# Altium schematic sheet CAN.SchDoc
size A4; SheetNumber: 3; SheetTotal: 5
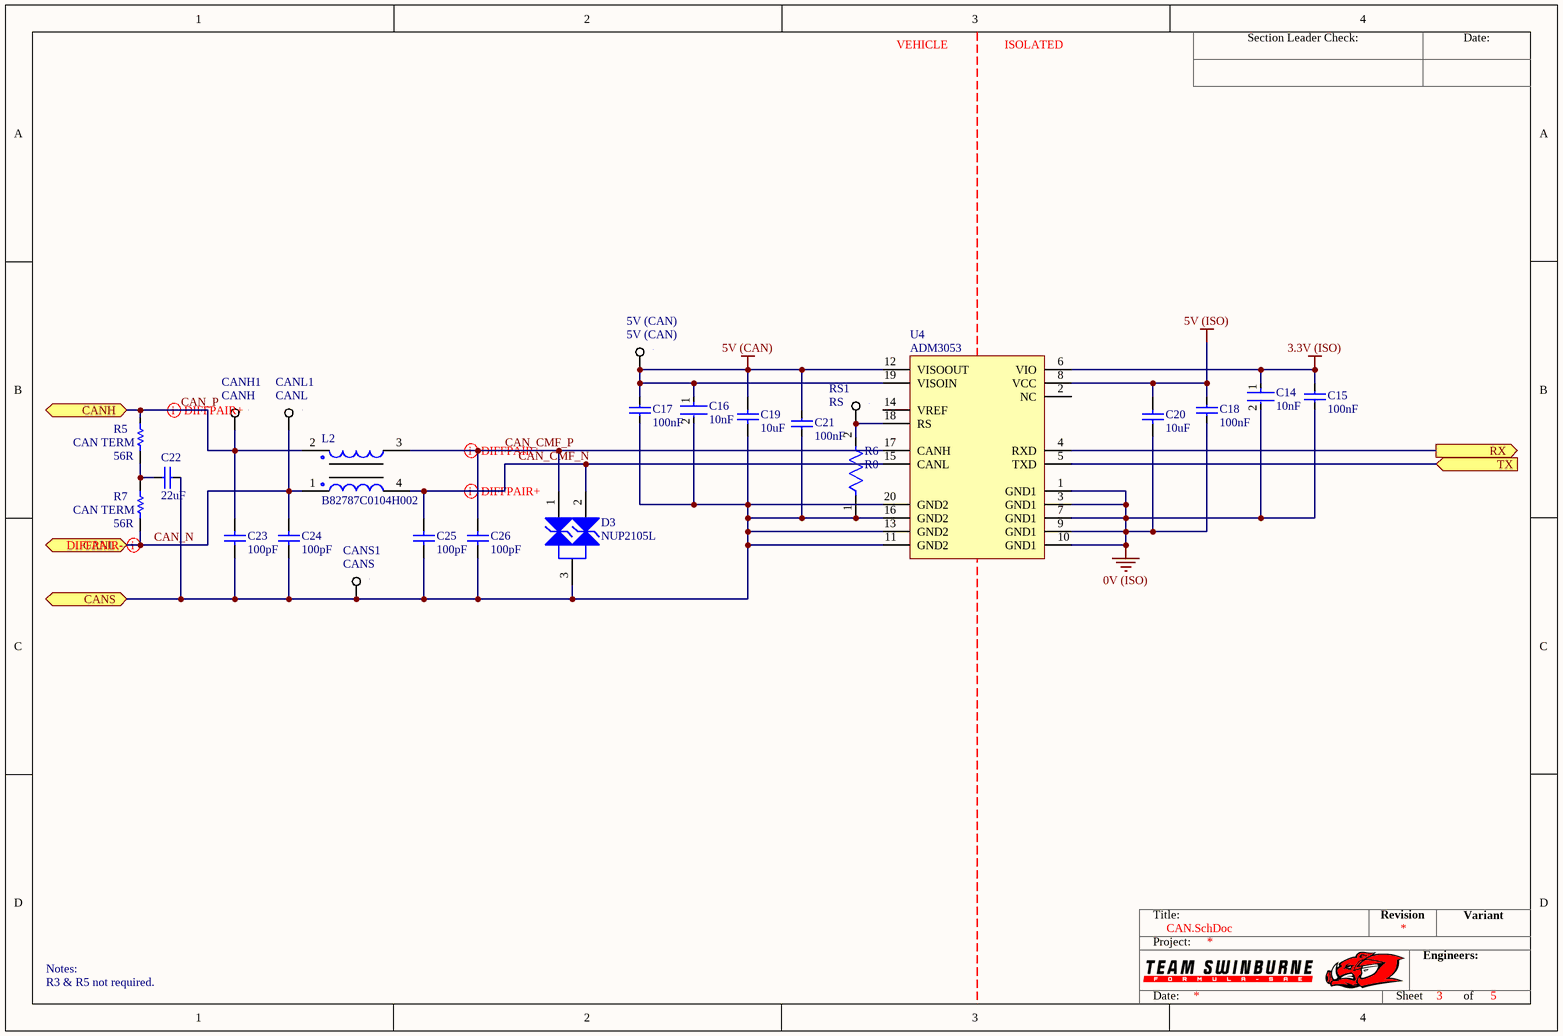
[diagram p0: CAN.SchDoc]

## Parts
5V_(CAN)  5V (CAN)  [SMD Test Point 1mm]
C14  10nF  [FP-GCM319-0_15-IPC_A]
C15  100nF  [0805]
C16  10nF  [FP-GCM319-0_15-IPC_A]
C17  100nF  [0805]
C18  100nF  [0805]
C19  10uF  [CAPC2013X145X50NL20T25]
C20  10uF  [CAPC2013X145X50NL20T25]
C21  100nF  [0805]
C22  22uF  [C0805C226M9PAC7210-Footprint-1]
C23  100pF  [CAPC2013X70X45NL15T25]
C24  100pF  [CAPC2013X70X45NL15T25]
C25  100pF  [CAPC2013X70X45NL15T25]
C26  100pF  [CAPC2013X70X45NL15T25]
CANH1  CANH  [SMD Test Point 1mm]
CANL1  CANL  [SMD Test Point 1mm]
CANS1  CANS  [SMD Test Point 1mm]
D3  NUP2105L  [ONSC-SOT-23-3-318-08_V]
L2  B82787C0104H002  [TDK 4-PC Pad]
R5  CAN TERM  value 56R  [RESC0603]
R6  R0  [FP-RC0805-IPC_A]
R7  CAN TERM  value 56R  [RESC0603]
RS1  RS  [SMD Test Point 1mm]
U4  ADM3053  [AD SOIC-W 20]

## Ports
CANH (bidir), CANL (bidir), CANS (bidir), RX (out), TX (in)

## Nets
0V (ISO): C14.2 C15.2 C18.2 C20.1 U4.1(GND1) U4.3(GND1) U4.7(GND1) U4.9(GND1) U4.10(GND1)
3.3V (ISO): C14.1 C15.1 U4.6(VIO)
5V (CAN): 5V_(CAN).1 C16.1 C17.1 C19.2 C21.1 U4.12(VISOOUT) U4.19(VISOIN)
5V (ISO): C18.1 C20.2 U4.8(VCC)
CAN_CMF_N: C25.2 D3.2(K) L2.4 U4.15(CANL)
CAN_CMF_P: C26.2 D3.1(K) L2.3 U4.17(CANH)
CAN_N: C24.2 CANL1.1 L2.1 R7.1 ; port CANL
CAN_P: C23.2 CANH1.1 L2.2 R5.2 ; port CANH
CANS: C16.2 C17.2 C19.1 C21.2 C22.2 C23.1 C24.1 C25.1 C26.1 CANS1.1 D3.3(K) R6.1 U4.11(GND2) U4.13(GND2) U4.16(GND2) U4.20(GND2) ; port CANS
RX: U4.4(RXD) ; port RX
TX: U4.5(TXD) ; port TX
NetC22_1: C22.1 R5.1 R7.2
NetR6_2: R6.2 RS1.1 U4.18(RS)

Not connected (* = marked no-connect by the designer): U4 2(NC) 14(VREF)

## Layout directives
differential pair: CAN_CMF_N, CAN_CMF_P, CAN_N, CAN_P

## Notes on the sheet
- VEHICLE
- ISOLATED
- Notes:
- R3 & R5 not required.
- Section Leader Check:
- Date:
- Title:
- Revision
- Variant
- Project:
- Engineers:
- Sheet
- of

## Library data of the parts
5V_(CAN) CANH1 CANL1 CANS1 RS1 = SMD Test Point Small: Positions: 1; Pitch: 0mm; Row Spacing: 0; Flange: No; Contact: NA; Part Number: SMD Test Point Small; Angle: 0
C14 C16 = CMP-CAP-0013-1: CAP CER 10000PF 100V NP0 1206; Dielectric: C0G; Tolerance: 5%; Width: 0.063inch; Max Operating Temperature: 125°C; Construction: Flat; Termination: SMD/SMT; RoHS Compliant: Yes; Voltage Rating: 100V; Radiation Hardening: No; Ratings: AEC-Q200; Package Quantity: 1; Case/Package: 1206; Capacitance: 10nF; Voltage Rating (DC): 100V; Case Code (Metric): 3216; Case Code (Imperial): 1206; Packaging: Tape and Reel; Depth: 1.6mm; Min Operating Temperature: -55°C; Lead Free: Lead Free; Thickness: 0.037inch; Mount: Surface Mount; Height: 0.85mm; Length: 3.2mm; Series: GCM
C15 C17 C18 C21 = CMP-00018-1: Cap Ceramic 0.1uF 25V X7R 10% Pad SMD 0805 125C Automotive T/R; Max Operating Temperature: 125°C; RoHS Compliant: Yes; Series: GCM; Case Code (Metric): 2012; Thickness: 0.055inch; Depth: 1.25mm; Width: 1.25mm; Package Quantity: 3000; Case Code (Imperial): 0805; Voltage Rating (DC): 25V; Dielectric: X7R; Construction: Flat; Height: 1.25mm; Ratings: AEC-Q200; Mount: Surface Mount; Voltage Rating: 25V; Tolerance: 10%; Length: 2mm; Case/Package: 0805; Packaging: Tape and Reel; Min Operating Temperature: -55°C; Radiation Hardening: No; Capacitance: 100nF; Termination: SMD/SMT
C19 C20 = CMP-CAP-0009-1: CAP CER 10UF 10V Y5V 0805; Dissipation Factor: 20%; Tolerance: 80%; Dielectric Material: Ceramic; Lead Free: Lead Free; Construction: Flat; Number of Pins: 2; Package Quantity: 1; Max Operating Temperature: 85°C; Resistor Type: Ceramic; Dielectric: Y5V; Capacitance: 10uF; Width: 0.049inch; REACH SVHC: No SVHC; Length: 2mm; Mount: Surface Mount; Case Code (Imperial): 0805; Case/Package: 0805; Termination: SMD/SMT; RoHS Compliant: Yes; Series: CC; Voltage Rating: 10V; Packaging: Tape and Reel; Depth: 1.25mm; Voltage Rating (DC): 10V; Height: 0.85mm; Thickness: 0.049inch; Case Code (Metric): 2012; Halogen Free: Halogen Free; Radiation Hardening: No; Min Operating Temperature: -30°C
C22 = CMP-CAP-0012-1: Cap Ceramic 22uF 6.3V X5R 20% Pad SMD 0805 85C T/R; Length: 2mm; Tolerance: 20%; Depth: 1.25mm; ComponentLink1URL: https://www.digikey.com.au/en/products/detail/kemet/C0805C226M9PAC7210/12701503?utm_adgroup=Ceramic%20Capacitors&utm_source=google&utm_medium=cpc&utm_campaign=Shopping_Product_Capacitors&utm_term=&productid=12701503&utm_id=go_cmp-1056236628_adg-53401090298_ad-250137101738_pla-354083418645_dev-c_ext-_prd-12701503_sig-CjwKCAjwnZaVBhA6EiwAVVyv9KTEcqdxbqdQeMdm15seaf-EwUH-KMZCmj15MsoZE7WO92Q0RAY2FRoCkrcQAvD_BwE&gclid=CjwKCAjwnZaVBhA6EiwAVVyv9KTEcqdxbqdQeMdm15seaf-EwUH-KMZCmj15MsoZE7WO92Q0RAY2FRoCkrcQAvD_BwE; Min Operating Temperature: -55°C; RoHS Compliant: Yes; Packaging: Tape and Reel; Dielectric: X5R; Capacitance: 22uF; ComponentLink1Description: Digikey Link; Max Operating Temperature: 85°C; Case/Package: 0805
C23-C26 = CMP-CAP-0014-1: Cap Ceramic 100pF 50V C0G 5% Pad SMD 0805 125C Automotive T/R; Package Quantity: 1; Case/Package: 0805; Dielectric: C0G; Packaging: Tape and Reel; Capacitance: 100pF; Length: 2mm; Tolerance: 5%; Construction: Flat; Thickness: 0.028inch; Series: GCM; Case Code (Imperial): 0805; Ratings: AEC-Q200; Width: 0.049inch; Min Operating Temperature: -55°C; Depth: 1.25mm; Radiation Hardening: No; Termination: SMD/SMT; Voltage Rating: 50V; Mount: Surface Mount; Height: 0.6mm; Max Operating Temperature: 125°C; RoHS Compliant: Yes; Case Code (Metric): 2012; Voltage Rating (DC): 50V
D3 = CMP-004-00000-1: NUP2105L Series 350 W Dual Line CAN Bus Protector ESD Protection Diode - SOT-23; Max Breakdown Voltage: 32V; Clamping Voltage: 44V; Number of Lines: 2; Direction: Bidirectional; Reverse Standoff Voltage: 24V; Min Breakdown Voltage: 26.2V; Peak Pulse Current: 8A; ESD Protection: Yes; Test Current: 1mA; Diode Type: ZENER; Max Power Dissipation: 350W; Capacitance: 30pF; Leakage Current: 100nA; Power Line Protection: No; Depth: 1.3mm; Package Quantity: 1; Element Configuration: Dual; Termination: SMD/SMT; Radiation Hardening: No; Min Operating Temperature: -55°C; Contact Plating: Tin,Matte; Packaging: Tape and Reel; Polarity: Bidirectional; Resistor Type: Zener; Clamping Voltage-Max: 44V; Height: 0.94mm; Max Surge Current: 8A; RoHS Compliant: Yes; Width: 1.3mm; Lead Free: Lead Free; Case/Package: SOT-23-3; Number of Channels: 2; Series: Automotive, AEC-Q101; Halogen Free: Halogen Free; Breakdown Voltage: 26.2V; Working Voltage: 24V; Operating Supply Voltage: 24V; Max Operating Temperature: 150°C; REACH SVHC: No SVHC; Number of Pins: 3; Max Reverse Leakage Current: 100nA; Peak Pulse Power: 350W; Length: 2.9mm; Number of Bidirectional Channels: 2
L2 = B82787C0104H002: 100µH @ 100kHz 2 Line Common Mode Choke Surface Mount 5.8 kOhms @ 10MHz 150mA DCR 2Ohm; Manufacturer: EPCOS (TDK); Material: Wirewound; Part Number: B82787C0104H002; Impedence: 5.8 kOhms @ 10MHz; Rated Current: 150mA; Digikey Part Number: 495-4598-1-ND; Digikey Link: https://www.digikey.com/product-detail/en/epcos-tdk/B82787C0104H002/495-4598-2-ND/3680998; Value: 100µH @ 100kHz
R5 R7 = CMP-RES-0049-1: RES SMD 56 OHM JUMPER 1/10W 0603; Tolerance: 1%; Power Rating: 100mW; Voltage Rating: 50V; Max Operating Temperature: 155°C; Case/Package: 0603; Min Operating Temperature: -55°C
R6 = CMP-00003-1: Res Thick Film 0805 0 Ohm Epoxy Pad SMD T/R; Tolerance: 1%; Max Power Dissipation: 125mW; Resistance: 0mR; Max Operating Temperature: 155°C; Features: Moisture Resistant; Case/Package: 0805; Length: 2mm; Depth: 1.25mm; Resistor Type: Thick Film; Case Code (Imperial): 0805; Min Operating Temperature: -55°C; Military Standard: Not; Number of Terminations: 2; Case Code (Metric): 2012; Radiation Hardening: No; Series: RC; RoHS Compliant: Yes; Power Rating: 125mW; Packaging: Tape and Reel; Lead Free: Lead Free; Size Code: 0805; Contact Plating: Tin,Matte; Construction: Rectangular
U4 = ADM3053: Isolated CAN Transceiver; Manufacturer: Analogue Devices; Part Number: ADM3053; Digikey Part Number: ADM3053BRWZ-ND; Digikey Link: https://www.digikey.com/product-detail/en/analog-devices-inc/ADM3053BRWZ/ADM3053BRWZ-ND/2709332